# EAGLE design H-bridge (EAGLE 6.3)
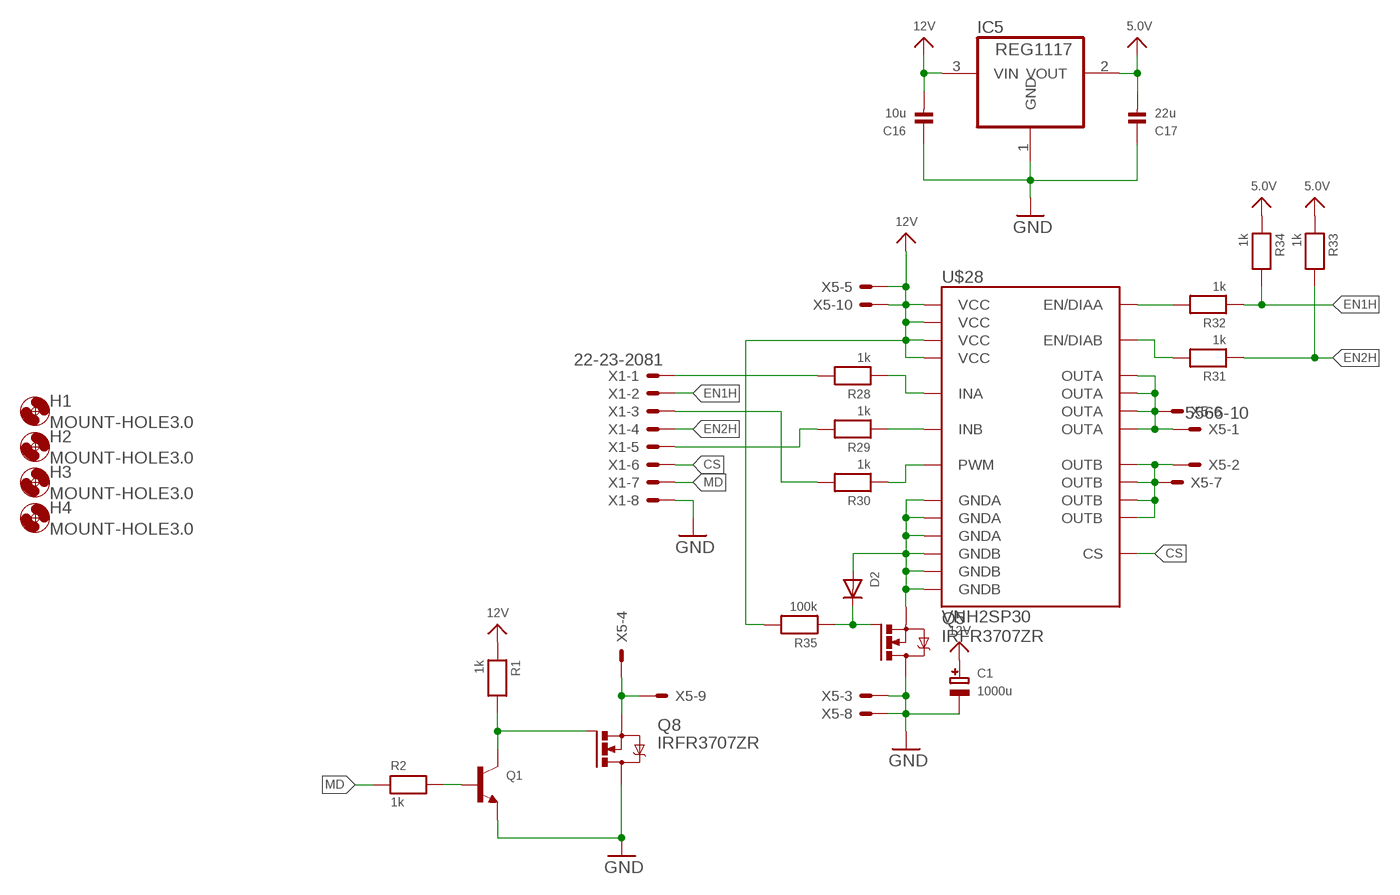
[diagram p0: schematic, sheet 1]

## Parts
C1  1000u  CAP_ELECTROLYTICPTH_3.5MMGRID_10MMDIA  [CELEC_3.5MM_10MM]
C16  10u  CAP_CERAMIC_0805  [_0805]
C17  22u  CAP_CERAMIC_0805  [_0805]
D2  DIODESMA  [SMADIODE]
H1  MOUNT-HOLE3.0  [3,0]
H2  MOUNT-HOLE3.0  [3,0]
H3  MOUNT-HOLE3.0  [3,0]
H4  MOUNT-HOLE3.0  [3,0]
IC5  REG1117  [SOT223]
Q1  TRANSISTOR_NPNWIDE  [SOT23-WIDE]
Q5  IRFR3707ZR  [D-PAK_TO252AA]
Q8  IRFR3707ZR  [D-PAK_TO252AA]
R1  1k  RESISTOR_0603  [_0603]
R2  1k  RESISTOR_0603  [_0603]
R28  1k  RESISTOR_0603  [_0603]
R29  1k  RESISTOR_0603  [_0603]
R30  1k  RESISTOR_0603  [_0603]
R31  1k  RESISTOR_0603  [_0603]
R32  1k  RESISTOR_0603  [_0603]
R33  1k  RESISTOR_0603  [_0603]
R34  1k  RESISTOR_0603  [_0603]
R35  100k  RESISTOR_0603  [_0603]
U$28  VNH2SP30  [VNH2SP30]
X1  22-23-2081  [22-23-2081]
X5  5566-10  [5566-10]

## Nets
5.0V: C17.2 IC5.2(VOUT) R33.1 R34.1
12V: C1.+ C16.2 IC5.3(VIN) R1.1 R35.2 U$28.3(VCC) U$28.13(VCC) U$28.23(VCC) U$28.SLUG1(VCC) X5.5 X5.10
CS: U$28.9(CS) X1.6
CVVM: U$28.15(OUTB) U$28.16(OUTB) U$28.21(OUTB) U$28.SLUG2(OUTB) X5.2 X5.7
EN1H: R32.1 R34.2 X1.2
EN2H: R31.1 R33.2 X1.4
GND: C1.- C16.1 C17.1 IC5.1(GND) Q1.2(E) Q5.4(D) Q8.4(D) X1.8 X5.3 X5.8
GNDM: Q8.3(S) X5.4 X5.9
GNDS: D2.A Q5.3(S) U$28.18(GNDB) U$28.19(GNDB) U$28.20(GNDB) U$28.26(GNDA) U$28.27(GNDA) U$28.28(GNDA)
MD: R2.1 X1.7
N$9: Q1.1(B) R2.2
N$11: Q1.3(C) Q8.1(G) R1.2
N$28: R30.1 U$28.8(PWM)
N$38: R29.1 U$28.11(INB)
N$39: R28.1 U$28.5(INA)
N$40: R31.2 U$28.10(EN/DIAB)
N$41: R32.2 U$28.6(EN/DIAA)
N$45: D2.C Q5.1(G) R35.1
N$71: R28.2 X1.1
N$72: R29.2 X1.5
N$73: R30.2 X1.3
OUTA: U$28.1(OUTA) U$28.25(OUTA) U$28.30(OUTA) U$28.SLUG3(OUTA) X5.1 X5.6

## Library data of the parts
C1 = microbuilder:CAP_ELECTROLYTIC: Electrolytic Capacitors SMT PANASONIC_C - Size C Panasonic Electrolytic Aluminum Capacitor 47µF 16V 20% Electrolytic Capacitor [Digikey: PCE3890TR-ND] PANASONIC_D - Size D Panasonic Electrolytic Aluminum Capacitor 100µF 25V 20% Electrolytic Capacitor [Digikey: PCE3898TR-ND] PTH 3.5 mm grid, 8 mm diameter ... 3.5 mm grid, 10 mm diameter ...
C16 C17 = microbuilder:CAP_CERAMIC: Ceramic Capacitors 0402 - 0402 Surface Mount Capacitors 16pF 50V 5% [Digikey: 445-4899-2-ND] 18pF 50V 5% [Digikey: 490-1281-2-ND] 22pF 50V 5% [Digikey: 490-1283-2-ND] 68pF 50V 5% [Digikey: 490-1289-2-ND] 0.1uF 10V 10% [Digikey: 490-1318-2-ND] 1.0uF 6.3V 10% [Digikey: 490-1320-2-ND] 0603 - 0603 Surface Mount Capacitors 16 pF 50V 5% [Digikey: 445-5051-2-ND] 22 pF 50V [Digikey: PCC220ACVTR-ND] 33 pF 50V 5% [Digikey: 490-1415-1-ND] 56pF 50V 5% [Digikey: 490-1421-1-ND] 220pF 50V 5% [Digikey: 445-1285-1-ND] 680 pF 50V 2200 pF 50V 5% C0G [Digikey: 445-1297-1-ND] 5600 pF 100V 5% X7R [Digikey: 478-3711-1-ND] 0.1 µF 25V 10% [Digikey: PCC2277TR-ND] 0.22 µF 16V 10% X7R [Digikey: 445-1318-1-ND] 1.0 µF 25V 10% [Digikey: 445-5146-2-ND] 0603 - RF Specific 3pF 250V +/-0.1pF RF [Digikey: 712-1347-1-ND] 18 pF 250V 5% [Digikey: 478-3505-1-ND or 712-1322-1-ND] 56 pF 250V 5% C0G RF [Digikey: 490-4867-1-ND] 68 pF 250V RF [Digikey: 490-4868-1-ND] 0805 - 0805 Surface Mount Capacitors 220 pF 250V 2% RF Ceramic Capacitor [Digikey: 712-1398-1-ND] 1000 pF 50V 2% NP0 Ceramic Capacitor [Digikey: 478-3760-1-ND] 0.1 µF 25V 10% Ceramic Capacitor [Digikey: PCC1828TR-ND] 1.0 µF 16V 10% Ceramic Capacitor[Digikey: 490-1691-2-ND] 10.0 µF 10V 10% Ceramic Capacitor[Digikey: 709-1228-1-ND] 10.0 uF 16V 10% Ceramic Capacitor [Digikey: 478-5165-2-ND] 47 uF 6.3V 20% Ceramic Capacitor [Digikey: 587-1779-1-ND or 399-5506-1-ND] 1206 - 1206 Surface Mount Capacitors 47uF 10V 20% Ceramic Capacitor [Digikey: 490-5528-1-ND or 399-5508-1-ND or 445-6010-1-ND] 100uF 6.3V -20%, +80% Y5V Ceramic Capacitor (Digikey: 490-4512-1-ND, Mouser: 81-GRM31CF50J107ZE1L)
D2 = microbuilder:DIODE: Diode SMA Model Volts Amps Type Vf Vr Digikey # Notes SSA34-E3 40V 3A Schottky 480mV @ 3A 200uA @ 40V SSA34-E3/61TGITR-ND CDBA120-G 20V 1A Schottky 500mV @ 1A 500uA @ 20V 641-1014-6-ND REEL MBRA210 10V 2A Schottky 350mV @ 2A 700uA @ 10V MBRA210LT3 SOD-123 Model Volts Amps Type Vf Vr Order # Notes BAT54T1G 30V 200mA Schottky 800mV @ 200mA 2uA @ 25V BAT54T1GOSTR-ND B0530W 30V 500mA Schottky 430mV @ 500mA 130uA @ 30V B0530W-FDICT-ND REEL MBR120 1A 20V Schottky 340mV @ 1A MBR120VLSFT1GOSCT-ND SOD-323 Model Volts Amps Type Vf Vr Order # Notes PMEG2005EJ 20V 500mA Schottky 355mV @ 500mA 568-4110-1-ND ZLLS410 10V 570mA Schottky 380mV @ 570mA ZLLS410CT-ND 1N4148WS 75V 150mA Silicon/Simple 1V 1N4148WSFSCT-ND REEL SOD-523 Model Volts Amps Type Vf Vr Order # Notes BAT54XV2 30V 200mA Schottky 0.8V @ 100mA BAT54XV2CT-ND TB751S 30V 30mA Schottky RB751S-40TE61CT-ND SOT23-R/W (R = Solder Paste/Reflow Ovens, W = Hand-Soldering) Model Volts Amps Type Vf Vr Order # Notes BAT54FILM 40V 300mA Schottky 497-7162-1-ND
H1-H4 = holes:MOUNT-HOLE: MOUNTING HOLE with drill center marker
IC5 = burr-brown:REG1117: 800mA and 1A Low Dropout (LDO) Positive Regulator 1.8V, 2.5V, 2.85V, 3.3V, 5V, and Adj; MPN: REG1117; OC_FARNELL: 1097566; OC_NEWARK: 14P6981
Q1 = microbuilder:TRANSISTOR_NPN: NPN Transistor Transistor (NPN) 500mA 45V - BC817 [Digikey: 568-1631-1-ND] Transistor (NPN) 500mA 45V - BC817,215 [Mouser: 771-BC817-T/R] SOT23-R - SOT23 footprint optimised for use with solder paste and reflow ovens. SOT23-W - SOT23 footprint optimised for hand-soldering (larger pads).
Q5 Q8 = UNICORN:IRFR3707Z: HEXFET Power MOSFET Source: http://www.irf.com/product-info/datasheets/data/irfr5305pbf.pdf
R1 R2 R28-R35 = microbuilder:RESISTOR: Resistors 0402 - 0402 Surface Mount Package 22 Ohm 1% 1/16W [Digikey: 311-22.0LRTR-ND] 33 Ohm 5% 1/16W 1.0K 5% 1/16W 1.5K 5% 1/16W 2.0K 1% 1/16W 10.0K 1% 1/16W [Digikey: 311-10.0KLRTR-ND] 10.0K 5% 1/16W [Digikey: RMCF0402JT10K0TR-ND] 12.1K 1% 1/16W [Digikey: 311-22.0LRTR-ND] 100.0K 5% 1/16W 0603 - 0603 Surface Mount Package 0 Ohm 1/10 Watt 1% Resistor 15 Ohm 1/10 Watt 1% Resistor 33 Ohm 1/10 Watt 1% Resistor 49.9 Ohm 1/10 Watt 1% Resistor 100 Ohm 1/10 Watt 1% Resistor 150 Ohm 1/10 Watt 1% Resistor 240 Ohm 1/10 Watt 1% Resistor 390 Ohm 1/10 Watt 1% Resistor 560 Ohm 1/10 Watt 1% Resistor 680 Ohm 1/10 Watt 1% Resistor 750 Ohm 1/10 Watt 1% Resistor 1.0K Ohm 1/10 Watt 1% Resistor 1.5K Ohm 1/10 Watt 1% Resistor 2.0K Ohm 1/10 Watt 1% Resistor 2.2K Ohm 1/10 Watt 1% Resistor 3.3K Ohm 1/10 Watt 1% Resistor 4.7K Ohm 1/10 Watt 1% Resistor 10.0K Ohm 1/10 Watt 1% Resistor 12.0K Ohm 1/10 Watt 1% Resistor 12.1K Ohm 1/10 Watt 1% Resistor 20.0K Ohm 1/10 Watt 1% Resistor 33.0K Ohm 1/10 Watt 1% Resistor 100.0K Ohm 1/10 Watt 1% Resistor 0805 - 0805 Surface Mount Package 0 Ohm 1/8 Watt 1% Resistor 33 Ohm 1/8 Watt 1% Resistor 100 Ohm 1/8 Watt 1% Resistor 150 Ohm 1/8 Watt 1% Resistor 200 Ohm 1/8 Watt 1% Resistor 240 Ohm 1/8 Watt 1% Resistor 330 Ohm 1/8 Watt 1% Resistor 390 Ohm 1/8 Watt 1% Resistor 470 Ohm 1/8 Watt 1% Resistor 1.0K Ohm 1/8 Watt 1% Resistor 1.5K Ohm 1/8 Watt 1% Resistor 2.0K Ohm 1/8 Watt 1% Resistor 4.7K Ohm 1/8 Watt 1% Resistor 5.1K Ohm 1/8 Watt 1% Resistor 5.6K Ohm 1/8 Watt 1% Resistor 10.0K Ohm 1/8 Watt 1% Resistor 22.0K Ohm 1/8 Watt 1% Resistor 33.0K Ohm 1/8 Watt 1% Resistor 100K Ohm 1/8 Watt 1% Resistor 1206 - 1206 Surface Mount Package 2012 - 2010 Surface Mount Package 0.11 Ohm 1/2 Watt 1% Resistor - Digikey: RHM.11UCT-ND
U$28 = SparkFun-PowerIC:VNH2SP30: 30A motor driver IC
X1 = con-molex:22-23-2081: .100" (2.54mm) Center Header - 8 Pin; MF: MOLEX; MPN: 22-23-2081; OC_FARNELL: 1756826; OC_NEWARK: 01C7592
X5 = con-molex:5566-10: Mini FIT connector 10 pol Source: http://www.molex.com; OC_FARNELL: unknown; OC_NEWARK: unknown

## Board
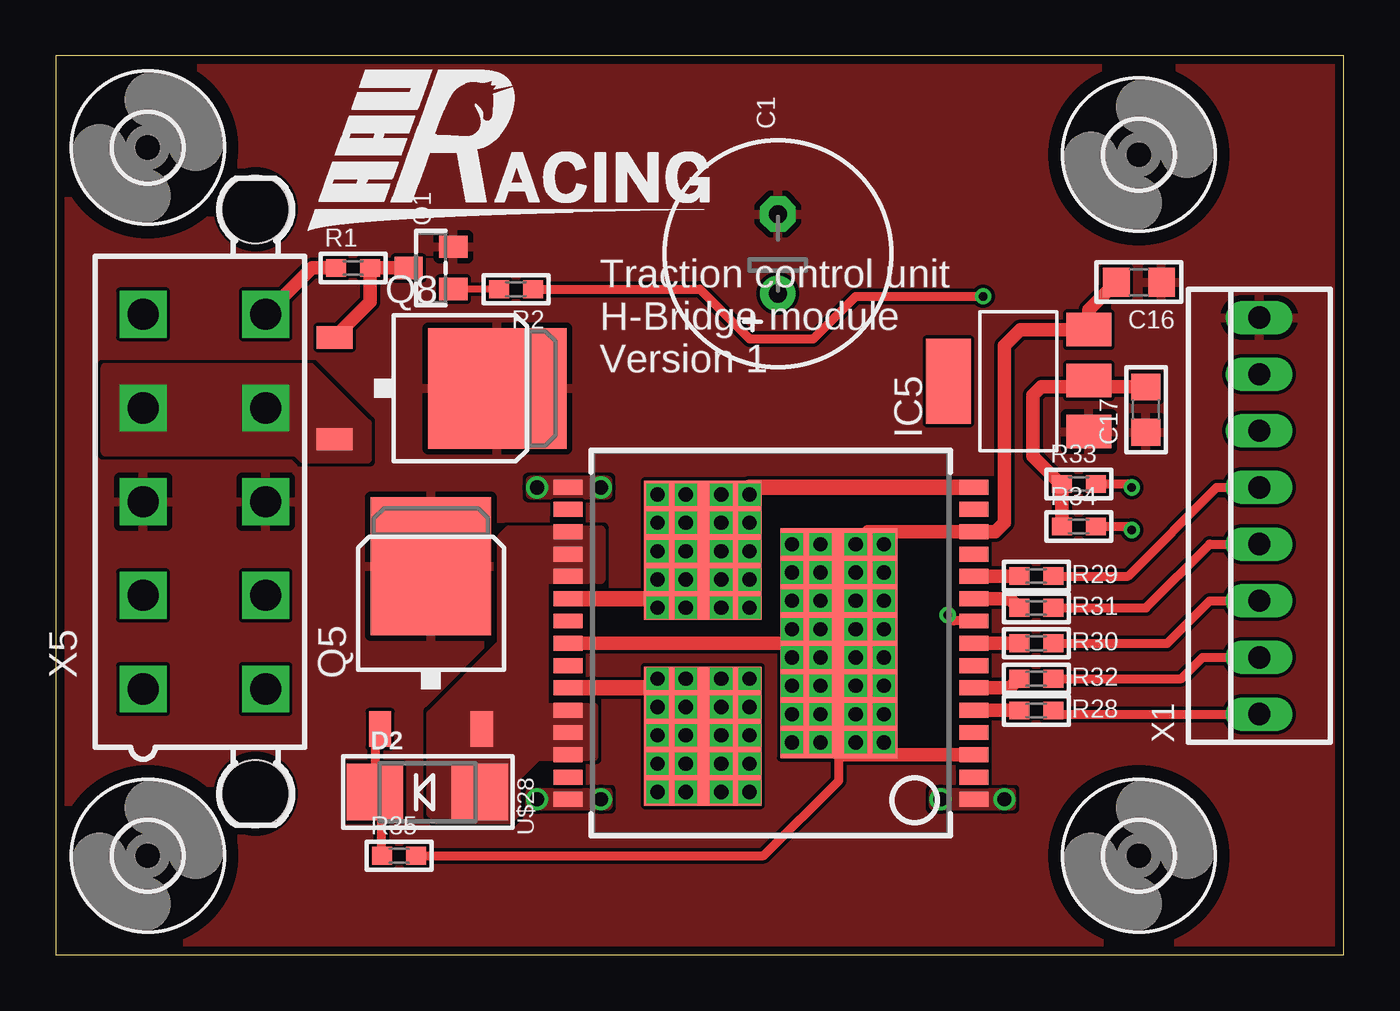
[diagram p1: board, top side]
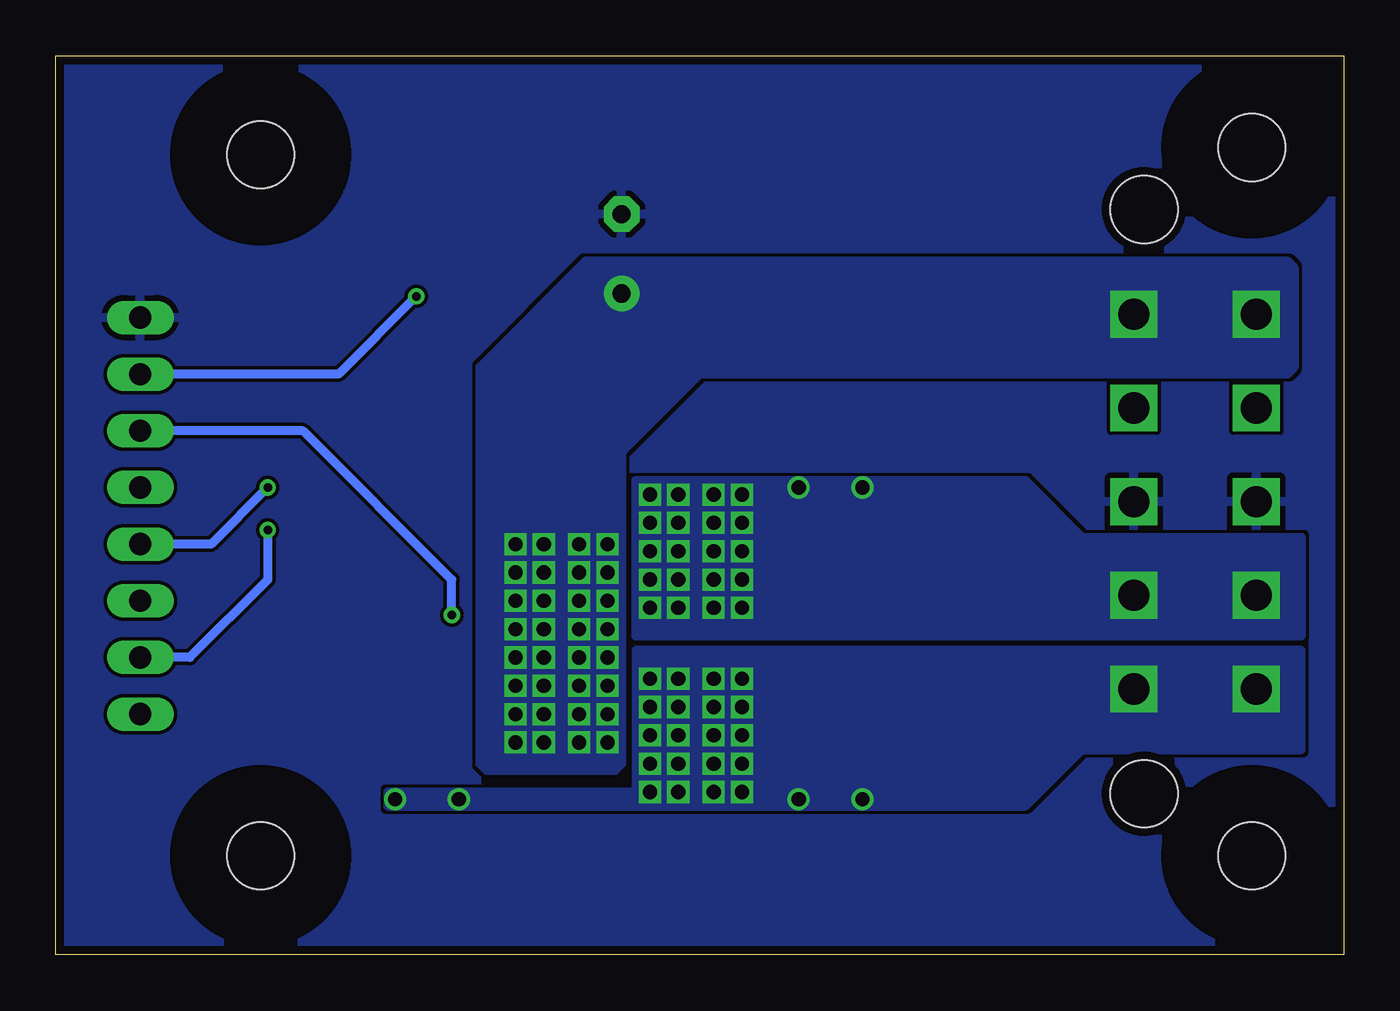
[diagram p2: board, bottom side, seen from below]

Size 57.76 x 40.31 mm. Coordinates in mm from the lower left corner, seen from the top.
Outline: 0,0 57.76,0 57.76,40.31 0,40.31 0,0
Copper layers (1*16): Top 0.0356mm / dielectric 1.5011mm / Bottom 0.0356mm
Design rules "LaenPCBOrder": minimum track width 6mil, minimum drill 13mil, track to track 6mil, track to pad 6mil, pad to pad 6mil, via to via 6mil, smd to smd 6mil, copper to edge 15mil, drill to drill 6mil, minimum pad ring 7mil, minimum via ring 7mil, stop-mask expansion 3mil, vias tented up to drill 0mil, thermal gap 10mil

### Footprints (pad centres in the part's own frame; a part is rotated, then mirrored left to right if it is on the bottom)
CELEC_3.5MM_10MM = drill 0.813 pad 1.6: + -1.778,0 | drill 0.813 pad 1.6 octagon: - 1.778,0
_0805 = smd 1.2 x 1.3: 1 -1.016,0; 2 1.016,0
SMADIODE = smd 2.54 x 2.54: A 2.349,0; C -2.349,0
3,0 = hole 3: 0,0
SOT223 = smd 1.499 x 2.007: 1 -2.261,-3.15; 2 0.025,-3.15; 3 2.311,-3.15 | smd 3.81 x 2.007: 4 0,3.15
SOT23-WIDE = smd 1 x 1.27: 1 -0.95,-1; 2 0.95,-1; 3 0,1
D-PAK_TO252AA = smd 1 x 1.6: 1 -2.28,-4.8; 3 2.28,-4.8 | smd 5.4 x 6.2: 4 0,2.5
_0603 = smd 0.9 x 0.8: 1 -0.762,0; 2 0.762,0
VNH2SP30 = smd 0.67 x 1.3: 1 -7,-9.1; 2 -6,-9.1; 3 -5,-9.1; 4 -4,-9.1; 5 -3,-9.1; 6 -2,-9.1; 7 -1,-9.1; 8 0,-9.1; 9 1,-9.1; 10 2,-9.1; 11 3,-9.1; 12 4,-9.1; 13 5,-9.1; 14 6,-9.1; 15 7,-9.1; 16 7,9.1; 17 6,9.1; 18 5,9.1; 19 4,9.1; 20 3,9.1; 21 2,9.1; 22 1,9.1; 23 0,9.1; 24 -1,9.1; 25 -2,9.1; 26 -3,9.1; 27 -4,9.1; 28 -5,9.1; 29 -6,9.1; 30 -7,9.1 | smd 10.3 x 5.25: SLUG1 0,-3.05 | smd 6.23 x 5.25: SLUG2 4.165,3.05; SLUG3 -4.165,3.05
22-23-2081 = drill 1 long: 1 -8.89,0; 2 -6.35,0; 3 -3.81,0; 4 -1.27,0; 5 1.27,0; 6 3.81,0; 7 6.35,0; 8 8.89,0
5566-10 = drill 1.4 square: 1 8.4,-2.75; 2 4.2,-2.75; 3 0,-2.75; 4 -4.2,-2.75; 5 -8.4,-2.75; 6 8.4,2.75; 7 4.2,2.75; 8 0,2.75; 9 -4.2,2.75; 10 -8.4,2.75 | hole 3: 13.1,2.29; -13.1,2.29

### Placement (x,y rotation side)
C1  32.38,31.43 90 top
C16  48.58,30.16 180 top
C17  48.9,24.45 90 top
D2  16.67,7.3 0 top
H1  4.13,4.45 0 top
H2  4.13,36.2 0 top
H3  48.58,4.45 0 top
H4  48.58,35.88 0 top
IC5  43.18,25.72 90 top
Q1  16.83,30.8 90 top
Q5  16.83,14.92 0 top
Q8  17.3,25.4 270 top
R1  13.33,30.8 0 top
R2  20.64,29.85 180 top
R28  43.97,10.95 0 top
R29  43.97,16.99 0 top
R30  43.97,13.97 0 top
R31  43.97,15.56 180 top
R32  43.97,12.38 180 top
R33  45.88,21.11 0 top
R34  45.88,19.21 0 top
R35  15.4,4.45 0 top
U$28  32.07,13.97 90 top
X1  53.97,19.68 90 top
X5  6.67,20.32 270 top

### Tracks (layer width: path | path; a pad name or v marks a point on that pad's centre or on a via)
5.0V
  Top 0.61: IC5.2 46.61,25.46 | 46.61,25.46 C17.2 | 46.61,25.46 44.2,25.46 43.82,25.08 43.82,22.35 45.05,21.11 R33.1 R34.1
12V  (via drill 0.64)
  Top 0.406: R35.2 31.75,4.44 35.12,7.81 35.12,9.53
  Top 0.61: U$28.23 U$28.SLUG1 35.12,9.53 35.12,8.97 U$28.3 | v35.88,18.42 36.43,18.97 U$28.13 42.15,18.97 42.54,19.37 42.54,27.31 43.27,28.03 IC5.3 46.33,28.93 C16.2 | X5.10 11.5,30.8 R1.1
  Top 0.686: v35.88,9.53 35.12,9.53
  other vias: 37.15,9.53 33.02,9.53 34.29,9.53 37.15,10.8 37.15,12.07 37.15,13.34 35.88,13.34 35.88,12.07 35.88,10.8 34.29,10.8 33.02,10.8 33.02,12.07 34.29,12.07 34.29,13.34 33.02,13.34 33.02,14.61 33.02,15.88 33.02,17.14 33.02,18.42 34.29,18.42 34.29,17.14 34.29,15.88 34.29,14.61 35.88,14.61 35.88,15.88 35.88,17.14 37.15,18.42 37.15,17.14 37.15,15.88 37.15,14.61
  pour Bottom (no thermals): 2.22,30.8 2.22,26.35 2.54,26.04 28.89,26.04 32.38,22.54 32.38,8.57 32.7,8.26 38.42,8.26 38.73,8.57 38.73,26.35 33.97,31.11 2.54,31.11
CS  (via drill 0.38)
  Top 0.406: U$28.9 40.28,14.97 v40,15.24
  Bottom 0.406: v40,15.24 40,16.83 46.67,23.5 X1.6
CVVM  (via drill 0.64)
  Top 0.686: U$28.21 28.26,15.97 v28.26,15.56 | v28.26,18.1 29.02,18.1 U$28.SLUG2 | U$28.15 31.11,20.97 v31.11,20.64
  other vias: 26.99,15.56 26.99,18.1 26.99,16.83 28.26,16.83 28.26,19.37 26.99,19.37 26.99,20.64 28.26,20.64 29.84,20.64 29.84,19.37 29.84,18.1 29.84,16.83 29.84,15.56 31.11,15.56 31.11,16.83 31.11,18.1 31.11,19.37 24.45,20.96 21.59,20.96
  pour Bottom (no thermals): 1.91,14.29 31.75,14.29 31.75,21.27 14.29,21.27 11.75,18.73 1.91,18.73
  pour Top (no thermals): 21.27,20.64 24.77,20.64 24.77,21.27 21.27,21.27
EN1H  (via drill 0.38)
  Top 0.406: R32.1 50.48,12.38 51.44,13.33 X1.2 | R34.2 48.1,19.21 v48.26,19.05
  Bottom 0.406: v48.26,19.05 48.26,16.83 51.75,13.33 X1.2
EN2H  (via drill 0.38)
  Top 0.406: R31.1 48.9,15.56 51.75,18.42 X1.4 | R33.2 48.1,21.11 v48.26,20.96
  Bottom 0.406: v48.26,20.96 50.8,18.42 X1.4
GND
  pour Bottom (rank 6): 0,0 57.78,0 57.78,40.64 0,40.64
  pour Top (rank 6): 0,0 57.78,0 57.78,40.64 0,40.64
GNDM
  pour Top (no thermals): 2.22,22.54 2.22,26.35 11.43,26.35 13.97,23.81 13.97,22.22 11.11,22.22 10.8,22.54
GNDS
  pour Top (no thermals): 20.32,19.05 24.45,19.05 24.45,16.83 21.91,16.83 21.91,11.11 24.13,11.11 24.13,8.89 21.59,8.89 20.64,7.94 20.64,6.35 20.32,6.03 17.14,6.03 16.83,6.35 16.83,10.8 20,13.97 20,18.73
MD  (via drill 0.38)
  Top 0.406: R2.1 28.89,29.85 31.11,27.62 33.97,27.62 35.88,29.53 v41.59,29.53
  Bottom 0.406: v41.59,29.53 45.09,26.03 X1.7
N$9
  Top 0.305: R2.2 Q1.1
N$11
  Top 0.61: Q8.1 14.1,29.27 R1.2 Q1.3
N$28
  Top 0.61: U$28.8 R30.1
N$38
  Top 0.61: U$28.11 43.21,16.97 R29.1
N$39
  Top 0.61: U$28.5 43.2,10.97 R28.1
N$40
  Top 0.61: U$28.10 42.8,15.97 R31.2
N$41
  Top 0.61: U$28.6 42.8,11.97 R32.2
N$45
  Top 0.406: 14.55,10.19 Q5.1 14.32,10.12 D2.C 14.32,6.67 14.61,6.67 14.61,4.44 R35.1
N$71
  Top 0.406: R28.2 44.89,10.8 X1.1
N$72
  Top 0.406: R29.2 48.1,16.99 52.07,20.96 X1.5
N$73
  Top 0.406: 44.74,13.95 R30.2 49.85,13.97 51.75,15.88 X1.3
OUTA  (via drill 0.64)
  Top 0.686: U$28.25 28.26,11.97 v28.26,12.38 | U$28.SLUG3 28.26,9.8 v28.26,9.84
  other vias: 26.99,12.38 29.84,12.38 31.11,12.38 26.99,11.11 28.26,11.11 29.84,11.11 31.11,11.11 31.11,9.84 29.84,9.84 26.99,9.84 26.99,8.57 28.26,8.57 29.84,8.57 31.11,8.57 26.99,7.3 28.26,7.3 29.84,7.3 31.11,7.3 39.69,6.98 42.54,6.98 24.45,6.98 21.59,6.98
  pour Bottom (no thermals): 1.91,13.65 31.75,13.65 31.75,7.3 42.86,7.3 42.86,6.67 14.29,6.67 11.75,9.21 1.91,9.21
  pour Top (no thermals): 39.37,7.3 42.86,7.3 42.86,6.67 39.37,6.67
  pour Top (no thermals): 21.27,7.3 24.77,7.3 24.77,6.67 21.27,6.67

### Text on the board
tSilk: Traction control unit / H-Bridge module / Version 1